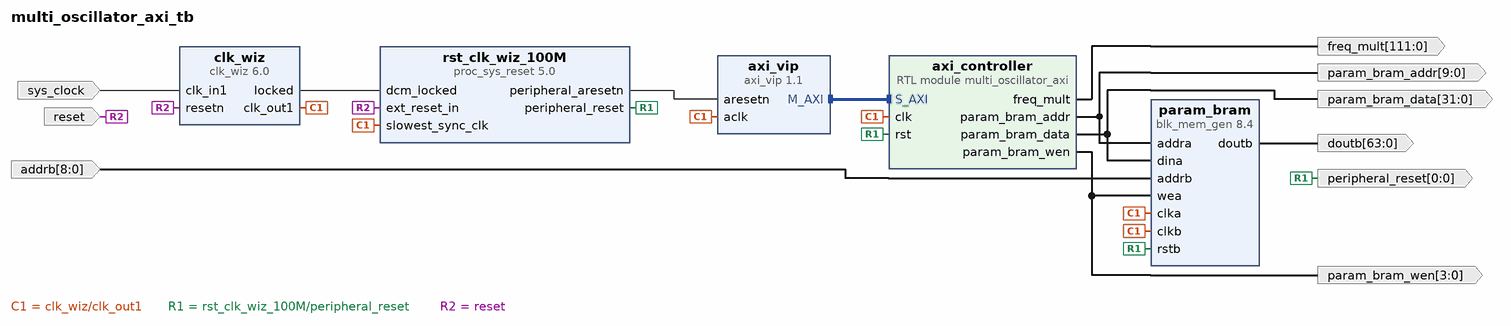
[diagram p0: block diagram of the top level]
# Vivado block design multi_oscillator_axi_tb, xc7a35ticsg324-1L, Vivado 2020.1
create_bd_design multi_oscillator_axi_tb

create_bd_port -dir O -from 111 -to 0 freq_mult
create_bd_port -dir I -from 8 -to 0 addrb
create_bd_port -dir O -from 63 -to 0 doutb
create_bd_port -dir O -from 9 -to 0 param_bram_addr
create_bd_port -dir O -from 31 -to 0 param_bram_data
create_bd_port -dir O -from 3 -to 0 param_bram_wen
create_bd_port -dir I -type clk sys_clock
set_property -dict {CONFIG.FREQ_HZ 100000000 CONFIG.PHASE 0.000} [get_bd_ports sys_clock]
create_bd_port -dir I -type rst reset
set_property -dict {CONFIG.POLARITY ACTIVE_LOW} [get_bd_ports reset]
create_bd_port -dir O -from 0 -to 0 -type rst peripheral_reset

create_bd_cell -type ip -vlnv xilinx.com:ip:blk_mem_gen:8.4 param_bram
set_property -dict [list \
  CONFIG.Assume_Synchronous_Clk true \
  CONFIG.Byte_Size 8 \
  CONFIG.EN_SAFETY_CKT false \
  CONFIG.Enable_32bit_Address false \
  CONFIG.Enable_A Always_Enabled \
  CONFIG.Enable_B Always_Enabled \
  CONFIG.Memory_Type Simple_Dual_Port_RAM \
  CONFIG.Operating_Mode_A WRITE_FIRST \
  CONFIG.Port_B_Clock 100 \
  CONFIG.Port_B_Enable_Rate 100 \
  CONFIG.Read_Width_B 64 \
  CONFIG.Register_PortB_Output_of_Memory_Primitives true \
  CONFIG.Use_Byte_Write_Enable true \
  CONFIG.Use_RSTB_Pin true \
  CONFIG.Write_Depth_A 1024 \
  CONFIG.Write_Width_A 32 \
  CONFIG.Write_Width_B 64 \
  CONFIG.use_bram_block Stand_Alone \
] [get_bd_cells param_bram]
create_bd_cell -type ip -vlnv xilinx.com:ip:axi_vip:1.1 axi_vip
set_property -dict [list \
  CONFIG.ADDR_WIDTH 32 \
  CONFIG.DATA_WIDTH 32 \
  CONFIG.HAS_BRESP 1 \
  CONFIG.HAS_PROT 1 \
  CONFIG.HAS_RRESP 1 \
  CONFIG.HAS_WSTRB 1 \
  CONFIG.INTERFACE_MODE MASTER \
  CONFIG.PROTOCOL AXI4LITE \
  CONFIG.READ_WRITE_MODE READ_WRITE \
] [get_bd_cells axi_vip]
create_bd_cell -type ip -vlnv xilinx.com:ip:clk_wiz:6.0 clk_wiz
set_property -dict [list \
  CONFIG.CLK_IN1_BOARD_INTERFACE sys_clock \
  CONFIG.RESET_BOARD_INTERFACE reset \
  CONFIG.RESET_PORT resetn \
  CONFIG.RESET_TYPE ACTIVE_LOW \
  CONFIG.USE_BOARD_FLOW true \
] [get_bd_cells clk_wiz]
create_bd_cell -type ip -vlnv xilinx.com:ip:proc_sys_reset:5.0 rst_clk_wiz_100M
set_property -dict {CONFIG.RESET_BOARD_INTERFACE reset CONFIG.USE_BOARD_FLOW true} [get_bd_cells rst_clk_wiz_100M]
create_bd_cell -type module -reference multi_oscillator_axi axi_controller

# ---- connections ----

connect_bd_intf_net -intf_net axi_vip_0_M_AXI [get_bd_intf_pins axi_controller/S_AXI] [get_bd_intf_pins axi_vip/M_AXI]
connect_bd_net -net clk_1 [get_bd_pins clk_wiz/clk_out1] \
  [get_bd_pins param_bram/clka] [get_bd_pins param_bram/clkb] [get_bd_pins axi_vip/aclk] \
  [get_bd_pins rst_clk_wiz_100M/slowest_sync_clk] [get_bd_pins axi_controller/clk]
connect_bd_net -net multi_oscillator_axi_0_freq_mult [get_bd_pins axi_controller/freq_mult] [get_bd_ports freq_mult]
connect_bd_net -net multi_oscillator_axi_0_param_bram_addr [get_bd_pins axi_controller/param_bram_addr] \
  [get_bd_pins param_bram/addra] [get_bd_ports param_bram_addr]
connect_bd_net -net multi_oscillator_axi_0_param_bram_data [get_bd_pins axi_controller/param_bram_data] \
  [get_bd_pins param_bram/dina] [get_bd_ports param_bram_data]
connect_bd_net -net multi_oscillator_axi_0_param_bram_wen [get_bd_pins axi_controller/param_bram_wen] \
  [get_bd_pins param_bram/wea] [get_bd_ports param_bram_wen]
connect_bd_net [get_bd_ports addrb] [get_bd_pins param_bram/addrb]
connect_bd_net -net blk_mem_gen_0_doutb [get_bd_pins param_bram/doutb] [get_bd_ports doutb]
connect_bd_net [get_bd_pins clk_wiz/locked] [get_bd_pins rst_clk_wiz_100M/dcm_locked]
connect_bd_net [get_bd_pins rst_clk_wiz_100M/peripheral_reset] \
  [get_bd_pins param_bram/rstb] [get_bd_ports peripheral_reset] [get_bd_pins axi_controller/rst]
connect_bd_net [get_bd_pins rst_clk_wiz_100M/peripheral_aresetn] [get_bd_pins axi_vip/aresetn]
connect_bd_net [get_bd_ports sys_clock] [get_bd_pins clk_wiz/clk_in1]
connect_bd_net [get_bd_ports reset] [get_bd_pins clk_wiz/resetn] [get_bd_pins rst_clk_wiz_100M/ext_reset_in]

# ---- address map ----
assign_bd_address -offset 0x00000000 -range 4G -target_address_space [get_bd_addr_spaces axi_vip/Master_AXI] [get_bd_addr_segs axi_controller/S_AXI/reg0]

validate_bd_design
save_bd_design
